# EAGLE design base_pcb_328_v3 (EAGLE 7.2.0)

## Sheet 1 of 3
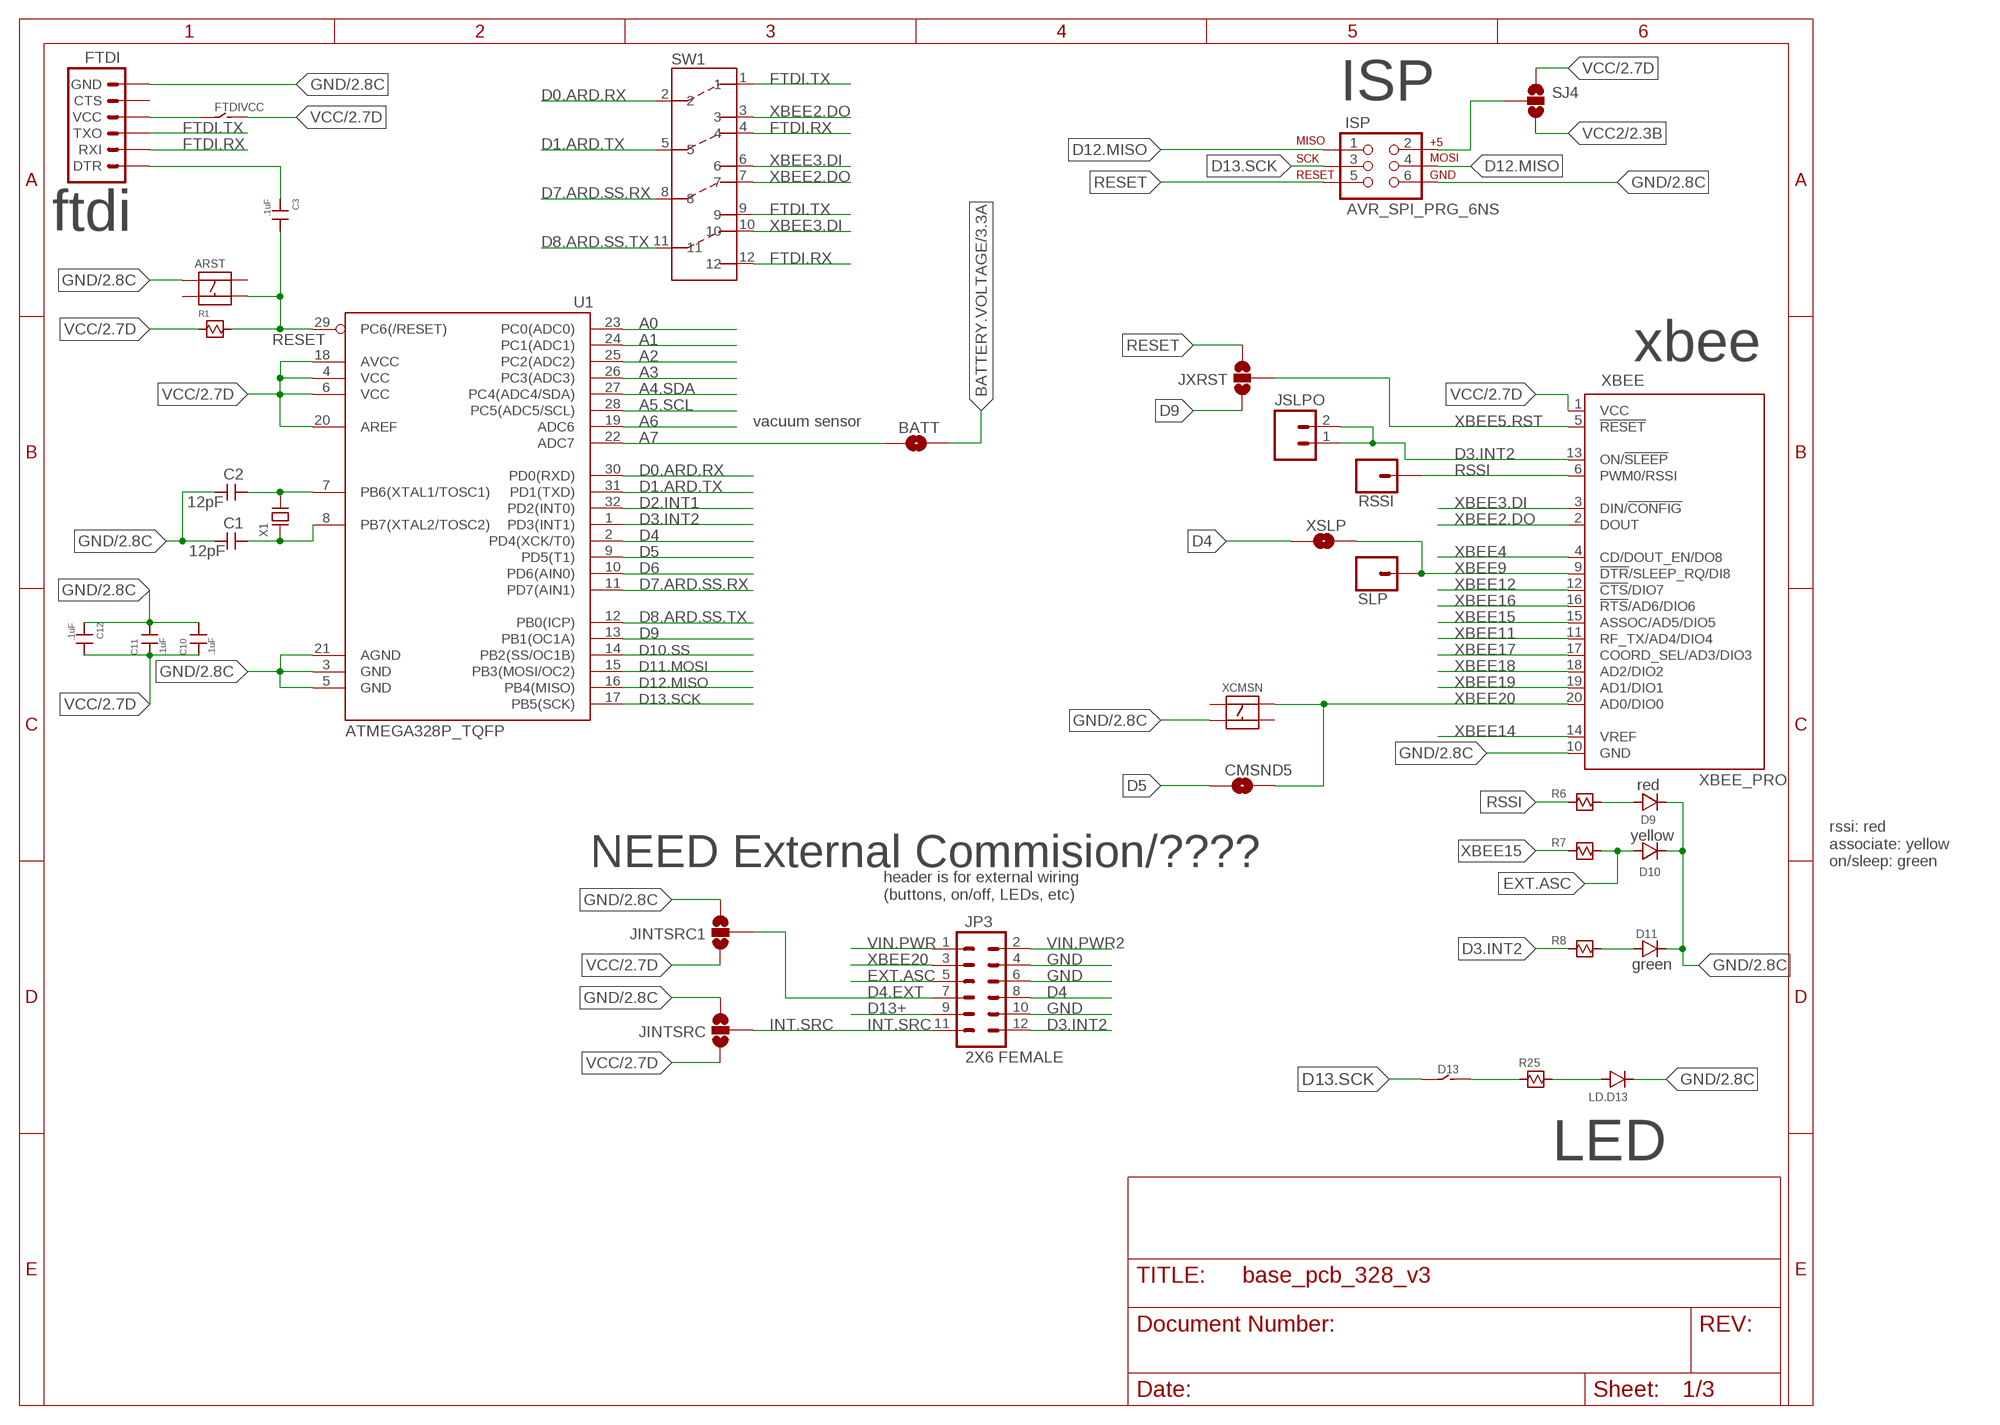
[diagram p0: schematic, sheet 1]

### Parts
ARST  C&K_PUSHBUTTON_SMALL_MOM_SPST_SMD  [C&K_PUSHBUTTON_MOM_SMALL_SPST_SMD]
BATT  JUMPER-PAD-2-NOYES_SILK  [PAD-JUMPER-2-NO_YES_SILK]
C1  12pF  0603_CAPACITOR  [0603_CAPACITOR]
C2  12pF  0603_CAPACITOR  [0603_CAPACITOR]
C3  .1uF  0603_CAPACITOR  [0603_CAPACITOR]
C10  .1uF  0402_CAPACITOR  [0402_CAPACITOR]
C11  .1uF  0402_CAPACITOR  [0402_CAPACITOR]
C12  .1uF  0402_CAPACITOR  [0402_CAPACITOR]
CMSND5  JUMPER-PAD-2-NOYES_SILK  [PAD-JUMPER-2-NO_YES_SILK]
D9  0603_LED  [0603_LED]
D10  0603_LED  [0603_LED]
D11  0603_LED  [0603_LED]
D13  JUMPER_2WAY_.1"_TH  [JUMPER_2WAY_.1"_TH]
FTDI  ARDUINO_SERIAL_PROGRAMPTH  [1X06]
FTDIVCC  JUMPER_2WAY_.1"_TH  [JUMPER_2WAY_.1"_TH]
ISP  AVR_SPI_PRG_6NS  [2X3-NS]
JINTSRC  JUMPER-PAD-3-NOYES_SILK  [PAD-JUMPER-3-NO_YES_SILK]
JINTSRC1  JUMPER-PAD-3-NOYES_SILK  [PAD-JUMPER-3-NO_YES_SILK]
JP3  2X6 FEMALE  M06X2PTH_FEMALE  [2X6]
JSLPO  M02PTH  [1X02]
JXRST  JUMPER-PAD-3-NOYES_SILK  [PAD-JUMPER-3-NO_YES_SILK]
LD.D13  0603_LED  [0603_LED]
R1  0603_RESISTOR  [0603_RESISTOR]
R6  0603_RESISTOR  [0603_RESISTOR]
R7  0603_RESISTOR  [0603_RESISTOR]
R8  0603_RESISTOR  [0603_RESISTOR]
R25  0603_RESISTOR  [0603_RESISTOR]
RSSI  M01PTH  [1X01]
SJ4  JUMPER-PAD-3-NOYES_SILK  [PAD-JUMPER-3-NO_YES_SILK]
SLP  M01PTH  [1X01]
SW1  COPAL_4PDT_SLIDE_SWITCH_TH  [COPAL_4PDT_SLIDE_SWITCH]
U1  ATMEGA328P_TQFP  [TQFP32-08]
X1  ABRACON_ABM3-16.000MHZ-D2Y-T_OSCILLATOR  [ABRACON_ABM3-16.000MHZ-D2Y-T_OSCILLATOR]
XBEE  XBEE_PRO  [XBEE_PRO]
XCMSN  C&K_PUSHBUTTON_SMALL_MOM_SPST_SMD  [C&K_PUSHBUTTON_MOM_SMALL_SPST_SMD]
XSLP  JUMPER-PAD-2-NOYES_SILK  [PAD-JUMPER-2-NO_YES_SILK]

### Nets
A0: U1.23(PC0(ADC0)) ; also sheet 2
A1: U1.24(PC1(ADC1)) ; also sheet 2
A2: U1.25(PC2(ADC2)) ; also sheet 2
A3: U1.26(PC3(ADC3)) ; also sheet 2
A4.SDA: U1.27(PC4(ADC4/SDA)) ; also sheet 2
A5.SCL: U1.28(PC5(ADC5/SCL)) ; also sheet 2
A6: U1.19(ADC6) ; also sheet 2
A7: BATT.1 U1.22(ADC7)
BATTERY.VOLTAGE: BATT.2 ; also sheet 3
D0.ARD.RX: SW1.2 U1.30(PD0(RXD))
D1.ARD.TX: SW1.5 U1.31(PD1(TXD))
D2.INT1: U1.32(PD2(INT0)) ; also sheet 2
D3.INT2: JP3.12 JSLPO.1 JSLPO.2 R8.1 U1.1(PD3(INT1)) XBEE.13(ON/!SLEEP) ; also sheet 2
D4: JP3.8 U1.2(PD4(XCK/T0)) XSLP.1 ; also sheet 2
D4.EXT: JINTSRC1.2 JP3.7
D5: CMSND5.1 U1.9(PD5(T1)) ; also sheet 2
D6: U1.10(PD6(AIN0)) ; also sheet 2
D7.ARD.SS.RX: SW1.8 U1.11(PD7(AIN1))
D8.ARD.SS.TX: SW1.11 U1.12(PB0(ICP))
D9: JXRST.1 U1.13(PB1(OC1A)) ; also sheet 2
D10.SS: U1.14(PB2(SS/OC1B)) ; also sheet 2
D11.MOSI: U1.15(PB3(MOSI/OC2)) ; also sheet 2
D12.MISO: ISP.1 ISP.4 U1.16(PB4(MISO)) ; also sheet 2
D13+: JP3.9
D13.SCK: D13.P$1 ISP.3 U1.17(PB5(SCK)) ; also sheet 2
EXT.ASC: D10.1 JP3.5 R7.2
FTDI.RX: FTDI.2(RXI)
FTDI.TX: FTDI.3(TXO)
GND: ARST.1 C1.2 C2.2 C10.2 C11.2 C12.1 D9.2 D10.2 D11.2 FTDI.6(GND) ISP.6 JINTSRC1.3 JINTSRC.3 JP3.4 JP3.6 JP3.10 LD.D13.2 U1.3(GND) U1.5(GND) U1.21(AGND) XBEE.10(GND) XCMSN.3 ; also sheet 2,3
INT.SRC: JINTSRC.2 JP3.11
N$1: C2.1 U1.7(PB6(XTAL1/TOSC1)) X1.P$2
N$2: C1.1 U1.8(PB7(XTAL2/TOSC2)) X1.P$1
N$3: C3.1 FTDI.1(DTR)
N$5: LD.D13.1 R25.2
N$6: D13.P$2 R25.1
N$11: ISP.2 SJ4.2
N$24: D9.1 R6.2
N$33: D11.1 R8.2
RESET: ARST.4 C3.2 ISP.5 JXRST.3 R1.2 U1.29(PC6(/RESET))
RSSI: R6.1 RSSI.1 XBEE.6(PWM0/RSSI) ; also sheet 2
VCC: C10.1 C11.1 C12.2 FTDI.4(VCC) FTDIVCC.P$1 FTDIVCC.P$2 JINTSRC1.1 JINTSRC.1 R1.1 SJ4.1 U1.4(VCC) U1.6(VCC) U1.18(AVCC) U1.20(AREF) XBEE.1(VCC) ; also sheet 2,3
VCC2: SJ4.3 ; also sheet 2,3
VIN.PWR: JP3.1 ; also sheet 2,3
VIN.PWR2: JP3.2 ; also sheet 3
XBEE2.DO: XBEE.2(DOUT) ; also sheet 2
XBEE3.DI: XBEE.3(DIN/!CONFIG) ; also sheet 2
XBEE4: XBEE.4(CD/DOUT_EN/DO8) ; also sheet 2
XBEE5.RST: JXRST.2 XBEE.5(!RESET) ; also sheet 2
XBEE9: SLP.1 XBEE.9(!DTR!/SLEEP_RQ/DI8) XSLP.2 ; also sheet 2
XBEE11: XBEE.11(RF_TX/AD4/DIO4) ; also sheet 2
XBEE12: XBEE.12(!CTS!/DIO7) ; also sheet 2
XBEE14: XBEE.14(VREF) ; also sheet 2
XBEE15: R7.1 XBEE.15(ASSOC/AD5/DIO5) ; also sheet 2
XBEE16: XBEE.16(!RTS!/AD6/DIO6) ; also sheet 2
XBEE17: XBEE.17(COORD_SEL/AD3/DIO3) ; also sheet 2
XBEE18: XBEE.18(AD2/DIO2) ; also sheet 2
XBEE19: XBEE.19(AD1/DIO1) ; also sheet 2
XBEE20: CMSND5.2 JP3.3 XBEE.20(AD0/DIO0) XCMSN.2 ; also sheet 2
Unconnected: ARST.2 ARST.3 FTDI.5(CTS) SW1.1 SW1.3 SW1.4 SW1.6 SW1.7 SW1.9 SW1.10 SW1.12 XCMSN.1 XCMSN.4

### Notes on the sheet
- ISP
- ftdi
- xbee
- vacuum sensor
- red
- yellow
- NEED External Commision/????
- rssi: red
  associate: yellow
  on/sleep: green
- header is for external wiring
  (buttons, on/off, LEDs, etc)
- green
- LED

## Sheet 2 of 3
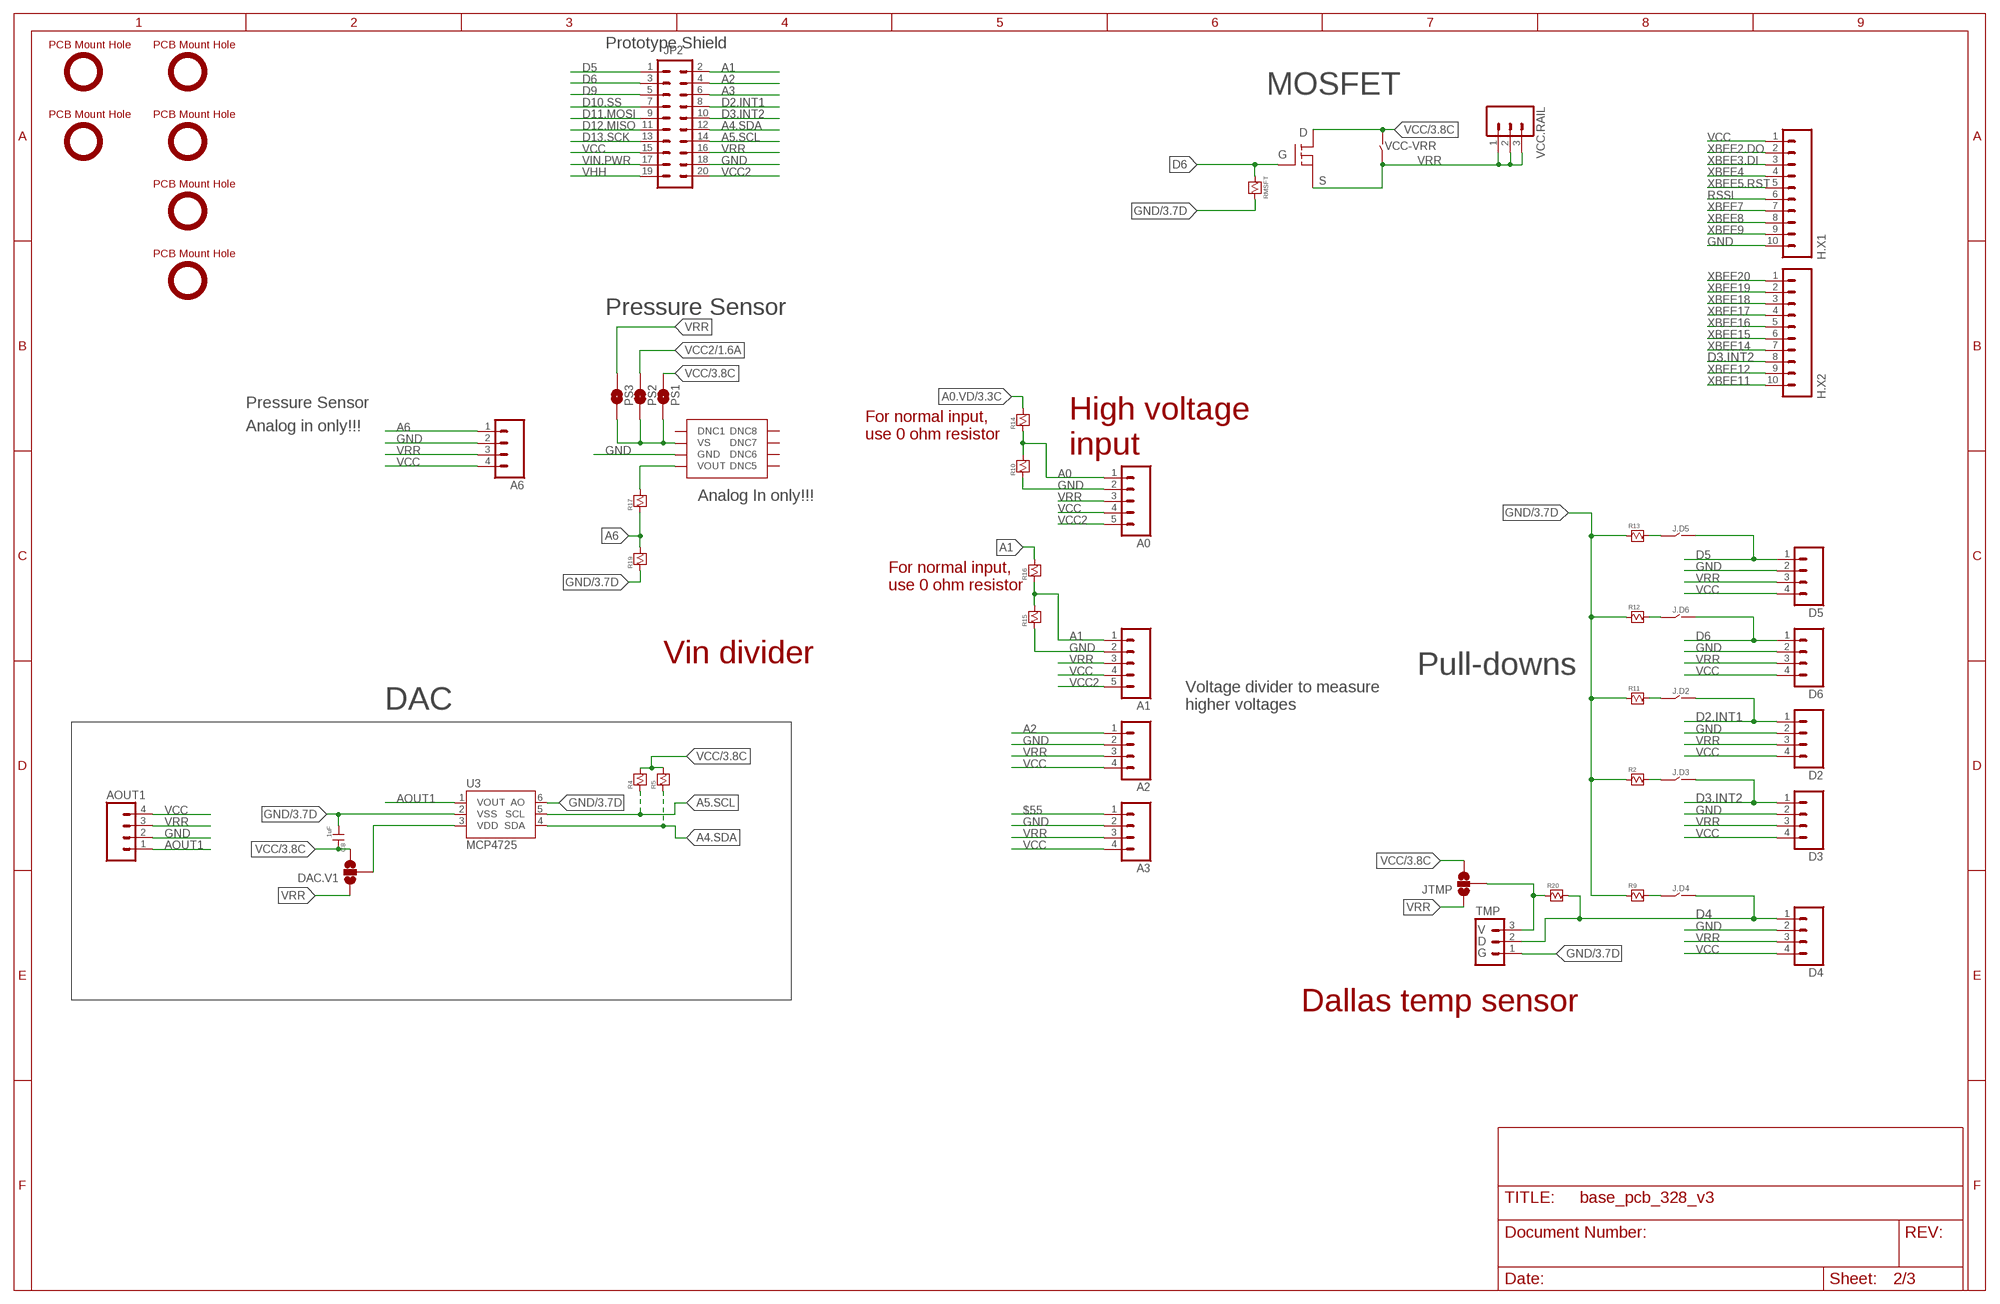
[diagram p1: schematic, sheet 2]

### Parts
A0  M05PTH  [1X05]
A1  M05PTH  [1X05]
A2  M04PTH  [1X04]
A3  M04PTH  [1X04]
A6  M04PTH  [1X04]
AOUT1  M04PTH  [1X04]
C8  .1uF  0603_CAPACITOR  [0603_CAPACITOR]
D2  M04PTH  [1X04]
D3  M04PTH  [1X04]
D4  M04PTH  [1X04]
D5  M04PTH  [1X04]
D6  M04PTH  [1X04]
DAC.V1  JUMPER-PAD-3-NOYES_SILK  [PAD-JUMPER-3-NO_YES_SILK]
H.X1  M10NO_SILK_PTH_FEMALE  [1X10_NO_SILK]
H.X2  M10NO_SILK_PTH_FEMALE  [1X10_NO_SILK]
J.D2  JUMPER_2WAY_.1"_TH  [JUMPER_2WAY_.1"_TH]
J.D3  JUMPER_2WAY_.1"_TH  [JUMPER_2WAY_.1"_TH]
J.D4  JUMPER_2WAY_.1"_TH  [JUMPER_2WAY_.1"_TH]
J.D5  JUMPER_2WAY_.1"_TH  [JUMPER_2WAY_.1"_TH]
J.D6  JUMPER_2WAY_.1"_TH  [JUMPER_2WAY_.1"_TH]
JP2  M10X2  [2X10]
JTMP  JUMPER-PAD-3-NOYES_SILK  [PAD-JUMPER-3-NO_YES_SILK]
PS1  JUMPER-PAD-2-NOYES_SILK  [PAD-JUMPER-2-NO_YES_SILK]
PS2  JUMPER-PAD-2-NOYES_SILK  [PAD-JUMPER-2-NO_YES_SILK]
PS3  JUMPER-PAD-2-NOYES_SILK  [PAD-JUMPER-2-NO_YES_SILK]
Q2  INFINEON_MOSFET_NCH  [INFINEON_MOSFET_NCH_SMD]
R2  0603_RESISTOR  [0603_RESISTOR]
R4  0603_RESISTOR  [0603_RESISTOR]
R5  0603_RESISTOR  [0603_RESISTOR]
R9  0603_RESISTOR  [0603_RESISTOR]
R10  0603_RESISTOR  [0603_RESISTOR]
R11  0603_RESISTOR  [0603_RESISTOR]
R12  0603_RESISTOR  [0603_RESISTOR]
R13  0603_RESISTOR  [0603_RESISTOR]
R14  0603_RESISTOR  [0603_RESISTOR]
R15  0603_RESISTOR  [0603_RESISTOR]
R16  0603_RESISTOR  [0603_RESISTOR]
R17  0603_RESISTOR  [0603_RESISTOR]
R19  0603_RESISTOR  [0603_RESISTOR]
R20  0603_RESISTOR  [0603_RESISTOR]
RMSFT  0603_RESISTOR  [0603_RESISTOR]
TMP  M03PTH  [1X03]
U3  MCP4725  MCP4725SOT-23  [SOT23-6]
U$2  PCB_HOLE  [PCB_HOLE]
U$4  PCB_HOLE  [PCB_HOLE]
U$5  PCB_HOLE  [PCB_HOLE]
U$6  PCB_HOLE  [PCB_HOLE]
U$9  MPXV6115VC6U  [MPXV6115VC6U]
U$13  PCB_HOLE  [PCB_HOLE]
U$14  PCB_HOLE  [PCB_HOLE]
VCC-VRR  JUMPER_2WAY_.1"_TH  [JUMPER_2WAY_.1"_TH]
VCC.RAIL  M03PTH  [1X03]

### Nets
$55: A3.1
A0: A0.1 R10.2 R14.1 ; also sheet 1
A0.VD: R14.2 ; also sheet 3
A1: A1.1 JP2.2 R15.2 R16.1 R16.2 ; also sheet 1
A2: A2.1 JP2.4 ; also sheet 1
A3: JP2.6 ; also sheet 1
A4.SDA: JP2.12 R5.1 U3.4(SDA) ; also sheet 1
A5.SCL: JP2.14 R4.1 U3.5(SCL) ; also sheet 1
A6: A6.1 R17.1 R19.2 ; also sheet 1
A6.IN: R17.2 U$9.4(VOUT)
AOUT1: AOUT1.1 U3.1(VOUT)
D2.INT1: D2.1 J.D2.P$2 JP2.8 ; also sheet 1
D3.INT2: D3.1 H.X2.8 J.D3.P$2 JP2.10 ; also sheet 1
D4: D4.1 J.D4.P$2 R20.2 TMP.2 ; also sheet 1
D5: D5.1 J.D5.P$2 ; also sheet 1
D6: D6.1 J.D6.P$2 JP2.3 Q2.G RMSFT.1 ; also sheet 1
D9: JP2.5 ; also sheet 1
D10.SS: JP2.7 ; also sheet 1
D11.MOSI: JP2.9 ; also sheet 1
D12.MISO: JP2.11 ; also sheet 1
D13.SCK: JP2.13 ; also sheet 1
GND: A0.2 A1.2 A2.2 A3.2 A6.2 AOUT1.2 C8.1 D2.2 D3.2 D4.2 D5.2 D6.2 H.X1.10 JP2.18 R2.1 R9.1 R10.1 R11.1 R12.1 R13.1 R15.1 R19.1 RMSFT.2 TMP.1 U3.2(VSS) U3.6(AO) U$9.3(GND) ; also sheet 1,3
N$13: PS1.1 PS2.1 PS3.1 U$9.2(VS)
N$20: J.D3.P$1 R2.2
N$21: J.D6.P$1 R12.2
N$22: J.D5.P$1 R13.2
N$25: J.D2.P$1 R11.2
N$34: J.D4.P$1 R9.2
N$35: JTMP.2 R20.1 TMP.3
RSSI: H.X1.6 ; also sheet 1
VCC: A0.4 A1.4 A2.4 A3.4 A6.4 AOUT1.4 C8.2 D2.4 D3.4 D4.4 D5.4 D6.4 DAC.V1.2 DAC.V1.3 H.X1.1 JP2.15 JTMP.3 PS1.2 Q2.D R4.2 R5.2 U3.3(VDD) VCC-VRR.P$2 ; also sheet 1,3
VCC2: A0.5 A1.5 PS2.2 ; also sheet 1,3
VIN.PWR: JP2.17 ; also sheet 1,3
VRR: A0.3 A1.3 A2.3 A3.3 A6.3 AOUT1.3 D2.3 D3.3 D4.3 D5.3 D6.3 DAC.V1.1 JP2.16 JTMP.1 PS3.2 Q2.S VCC-VRR.P$1 VCC.RAIL.1 VCC.RAIL.2 VCC.RAIL.3
XBEE2.DO: H.X1.2 ; also sheet 1
XBEE3.DI: H.X1.3 ; also sheet 1
XBEE4: H.X1.4 ; also sheet 1
XBEE5.RST: H.X1.5 ; also sheet 1
XBEE7: H.X1.7
XBEE8: H.X1.8
XBEE9: H.X1.9 ; also sheet 1
XBEE11: H.X2.10 ; also sheet 1
XBEE12: H.X2.9 ; also sheet 1
XBEE14: H.X2.7 ; also sheet 1
XBEE15: H.X2.6 ; also sheet 1
XBEE16: H.X2.5 ; also sheet 1
XBEE17: H.X2.4 ; also sheet 1
XBEE18: H.X2.3 ; also sheet 1
XBEE19: H.X2.2 ; also sheet 1
XBEE20: H.X2.1 ; also sheet 1
Unconnected: JP2.1 JP2.19 JP2.20 U$9.1(DNC1) U$9.5(DNC5) U$9.6(DNC6) U$9.7(DNC7) U$9.8(DNC8)

### Notes on the sheet
- Prototype Shield
- MOSFET
- Pressure Sensor
- Pressure Sensor
- Analog in only!!!
- For normal input, 
  use 0 ohm resistor
- High voltage 
  input
- Analog In only!!!
- For normal input, 
  use 0 ohm resistor
- Vin divider
- Pull-downs
- DAC
- Voltage divider to measure 
  higher voltages
- V
- D
- G
- Dallas temp sensor

## Sheet 3 of 3
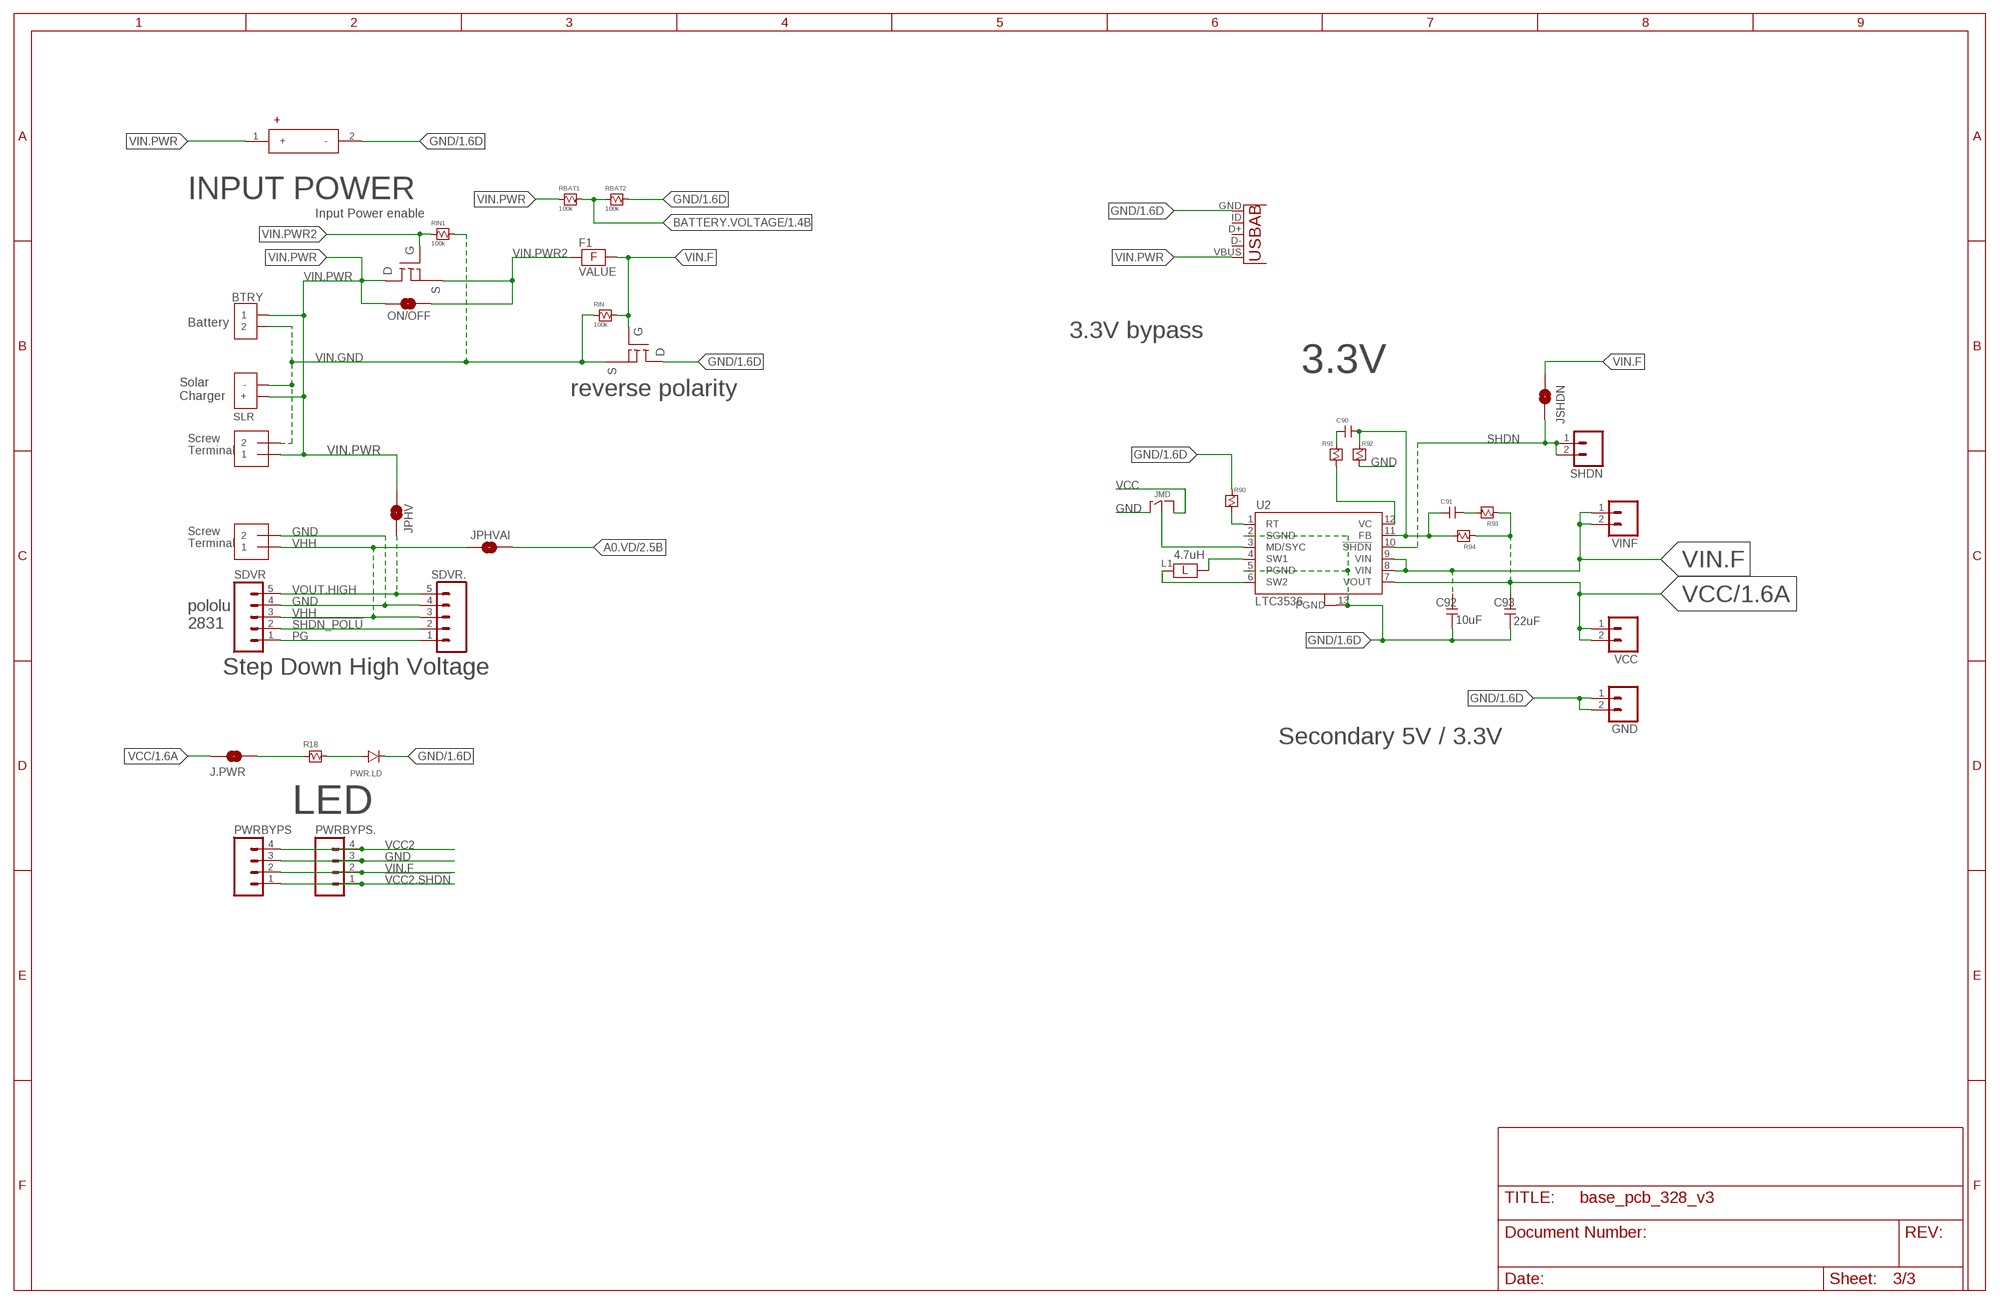
[diagram p2: schematic, sheet 3]

### Parts
BATTERY  BATTERY_HOLDER_18650  [BATTERY_HOLDER_18650]
BTRY  MOLEX_2PIN_LOCKING_TH  [MOLEX_2PIN_LOCKING_TH]
C90  0603_CAPACITOR  [0603_CAPACITOR]
C91  0603_CAPACITOR  [0603_CAPACITOR]
C92  10uF  0805_CAPACITOR  [0805_CAPACITOR]
C93  22uF  0805_CAPACITOR  [0805_CAPACITOR]
F1  PTC_FUSE_PTC_1206  [BEL_FUSE_PTC_FUSE_1206]
GND  M02PTH  [1X02]
INHPWR  1X2-3.5MM  [1X2-3.5MM]
INPWR  1X2-3.5MM  [1X2-3.5MM]
J.PWR  JUMPER-PAD-2-NOYES_SILK  [PAD-JUMPER-2-NO_YES_SILK]
JMD  JUMPER_3WAY_.1"_TH  [JUMPER_3WAY_.1"_TH]
JPHV  JUMPER-PAD-2-NOYES_SILK  [PAD-JUMPER-2-NO_YES_SILK]
JPHVAI  JUMPER-PAD-2-NOYES_SILK  [PAD-JUMPER-2-NO_YES_SILK]
JSHDN  JUMPER-PAD-2-NOYES_SILK  [PAD-JUMPER-2-NO_YES_SILK]
L1  4.7uH  BOURNS_INDUCTOR_SMD  [BOURNS_INDUCTOR_SMD]
ON/OFF  JUMPER-PAD-2-NOYES_SILK  [PAD-JUMPER-2-NO_YES_SILK]
PWR.LD  0603_LED  [0603_LED]
PWRBYPS  M04PTH  [1X04]
PWRBYPS.  M04PTH  [1X04]
Q1  INFINEON_MOSFET_NCH  [INFINEON_MOSFET_NCH_SMD]
Q3  INFINEON_MOSFET_NCH  [INFINEON_MOSFET_NCH_SMD]
R18  0603_RESISTOR  [0603_RESISTOR]
R90  0603_RESISTOR  [0603_RESISTOR]
R91  0603_RESISTOR  [0603_RESISTOR]
R92  0603_RESISTOR  [0603_RESISTOR]
R93  0603_RESISTOR  [0603_RESISTOR]
R94  0603_RESISTOR  [0603_RESISTOR]
RBAT1  100k  0603_RESISTOR  [0603_RESISTOR]
RBAT2  100k  0603_RESISTOR  [0603_RESISTOR]
RIN  100k  0603_RESISTOR  [0603_RESISTOR]
RIN1  100k  0603_RESISTOR  [0603_RESISTOR]
SDVR  M05PTH  [1X05]
SDVR.  M05PTH  [1X05]
SHDN  M02PTH  [1X02]
SLR  HEATH_SOLAR_CHARGER  [HEATH_SOLAR_CHARGER]
U2  LTC3536_ADJ_12PIN  [LTC3536_ADJ_12PIN]
U4  USB-AB  [USB-AB-MICRO-SMD]
VCC  M02PTH  [1X02]
VINF  M02PTH  [1X02]

### Nets
!SHDN_POLU: SDVR.2 SDVR..2
!VCC2.SHDN: PWRBYPS.1 PWRBYPS..1
A0.VD: JPHVAI.1 ; also sheet 2
BATTERY.VOLTAGE: RBAT1.2 RBAT2.1 ; also sheet 1
GND: BATTERY.2(-) C92.1 C93.1 GND.1 GND.2 INHPWR.2 JMD.P$3 PWR.LD.2 PWRBYPS.3 PWRBYPS..3 Q1.D R90.2 R92.1 RBAT2.2 SDVR.4 SDVR..4 U2.2(SGND) U2.5(PGND) U2.13(PGND) U4.GND ; also sheet 1,2
N$12: L1.P$2 U2.4(SW1)
N$15: J.PWR.1 R18.1
N$16: PWR.LD.1 R18.2
N$23: L1.P$1 U2.6(SW2)
N$26: R90.1 U2.1(RT)
N$27: C90.2 C91.1 R92.2 R94.2 U2.11(FB)
N$28: C90.1 R91.2
N$29: R91.1 U2.12(VC)
N$30: C91.2 R93.2
N$31: JMD.P$2 U2.3(MD/SYC)
PG: SDVR.1 SDVR..1
SHDN: JSHDN.2 SHDN.1 SHDN.2 U2.10(!SHDN)
VCC: C93.2 J.PWR.2 JMD.P$1 R93.1 R94.1 U2.7(VOUT) VCC.1 VCC.2 ; also sheet 1,2
VCC2: PWRBYPS.4 PWRBYPS..4 ; also sheet 1,2
VHH: INHPWR.1 JPHVAI.2 SDVR.3 SDVR..3 ; also sheet 2
VIN.F: C92.2 F1.P$2 JSHDN.1 PWRBYPS.2 PWRBYPS..2 Q1.G RIN.2 U2.8(VIN) U2.9(VIN) VINF.1 VINF.2
VIN.GND: BTRY.2 INPWR.2 Q1.S RIN1.2 RIN.1 SLR.-
VIN.PWR: BATTERY.1(+) BTRY.1 INPWR.1 JPHV.2 ON/OFF.1 Q3.D RBAT1.1 SLR.+ U4.VBUS ; also sheet 1,2
VIN.PWR2: F1.P$1 ON/OFF.2 Q3.G Q3.S RIN1.1 ; also sheet 1
VOUT.HIGH: JPHV.1 SDVR.5 SDVR..5
Unconnected: U4.D+ U4.D- U4.ID(USBID)

### Notes on the sheet
- INPUT POWER
- Input Power enable
- Battery
- 3.3V bypass
- 3.3V
- reverse polarity
- Solar 
  Charger
- Screw
  Terminal
- Screw
  Terminal
- 4.7uH
- pololu
  2831
- Step Down High Voltage
- Secondary 5V / 3.3V
- LED

## Library data of the parts
A0 A1 SDVR SDVR. = SparkFun-Connectors:M05: Header 5 Standard 5-pin 0.1" header. Use with straight break away headers (SKU : PRT-00116), right angle break away headers (PRT-00553), swiss pins (PRT-00743), machine pins (PRT-00117), and female headers (PRT-00115). Molex polarized connector foot print use with SKU : PRT-08230 with associated crimp pins and housings.
A2 A3 A6 AOUT1 D2-D6 PWRBYPS PWRBYPS. = SparkFun-Connectors:M04: Header 4 Standard 4-pin 0.1" header. Use with straight break away headers (SKU : PRT-00116), right angle break away headers (PRT-00553), swiss pins (PRT-00743), machine pins (PRT-00117), and female headers (PRT-00115). Molex polarized connector foot print use with SKU : PRT-08231 with associated crimp pins and housings. 1MM SMD Version SKU: PRT-10208
ARST XCMSN = Heath_control:C&K_PUSHBUTTON_SMALL_MOM_SPST_SMD: C&K: KMR742NG LFS Digikey: CKN10689CT-ND Description: SWITCH TACTILE SPST-NO 50MA 32V
BATT CMSND5 J.PWR JPHV JPHVAI JSHDN ON/OFF PS1-PS3 XSLP = SparkFun-Passives:JUMPER-PAD-2-NO
BATTERY = Heath_hardware:BATTERY_HOLDER_18650: Digikey: 36-1042-ND Keystone: 1042 Description: HOLDER BATTERY 1CELL 18650 SMD
BTRY = Heath_connectors:MOLEX_2PIN_LOCKING_TH: 2pin locking through hole
C1-C3 C8 C90 C91 = Heath_components:0603_CAPACITOR
C10-C12 = Heath_components:0402_CAPACITOR
C92 C93 = Heath_components:0805_CAPACITOR: 0805 samsung capacitor
D9-D11 LD.D13 PWR.LD = Heath_components:0603_LED
D13 FTDIVCC J.D2-J.D6 VCC-VRR = Heath_passives:JUMPER_2WAY_.1"_TH
DAC.V1 JINTSRC JINTSRC1 JTMP JXRST SJ4 = SparkFun-Passives:JUMPER-PAD-3-NO
F1 = Heath_circuit_protection:PTC_FUSE_PTC_1206: PTC resettable fuse, Bel Fuse, 1206 footprint
FTDI = SparkFun-Connectors:ARDUINO_SERIAL_PROGRAM: FTDI connector footprints
GND JSLPO SHDN VCC VINF = SparkFun-Connectors:M02: Standard 2-pin 0.1" header. Use with - straight break away headers ( PRT-00116) - right angle break away headers (PRT-00553) - swiss pins (PRT-00743) - machine pins (PRT-00117) - female headers (PRT-00115) Molex polarized connector foot print use with: PRT-08233 with associated crimp pins and housings. 2.54_SCREWTERM for use with PRT-10571. 3.5mm Screw Terminal footprints for PRT-08084 5mm Screw Terminal footprints for use with PRT-08432
H.X1 H.X2 = SparkFun-Connectors:M10: Header 10 Standard 10-pin 0.1" header. Use with straight break away headers (SKU : PRT-00116), right angle break away headers (PRT-00553), swiss pins (PRT-00743), machine pins (PRT-00117), and female headers (PRT-00115).; PROD_ID: CONN-11563
INHPWR INPWR = adafruit:1X2: 3.5mm Terminal block http://www.ladyada.net/library/pcb/eaglelibrary.html
ISP = SparkFun-Connectors:AVR_SPI_PRG_6: AVR ISP 6 Pin This is the reduced ISP connector for AVR programming. Common on Arduino. This footprint will take up less PCB space and can be used with a 10-pin to 6-pin adapter such as SKU: BOB-08508 **Special note about "TEST_POINT" package. The stop mask is on the top side, so if you want your programming test points to be on the bottom of your board, make sure to place this package on the bottom side of the board. This also ensure that the orientation to program from the bottom side will be correct.
JMD = Heath_passives:JUMPER_3WAY_.1"_TH
JP2 = SparkFun-Connectors:M10X2: This was SPECIALLY designed to be used with our Graphic LCD Backpack. Be sure you want to use this! It is not only staggered on each line of header holes, but IT IS ALSO offset of the center point of the top and bottom lines by 5 mil. This causes the headers to lock into place on the "standard" footprint on the LCD screen. The extra squares on the tdocu layer are there simply to reference other pins (if you were to actually populate a longer header than ten long - this is what we do with the backpacks).
JP3 = SparkFun-Connectors:M06X2; PROD_ID: CONN-12423
L1 = Heath_components:BOURNS_INDUCTOR_SMD: bourns inductor, 2.2uH - 10uH +, smd
Q1-Q3 = Heath_components:INFINEON_MOSFET_NCH: Infineon:IRLML6344TRPBF Digikey: IRLML6344TRPBFCT-ND Description: MOSFET N-CH 30V 5A SOT23
R1 R2 R4-R20 R25 R90-R94 RBAT1 RBAT2 RIN RIN1 RMSFT = Heath_components:0603_RESISTOR: 0603 footprint
RSSI SLP = SparkFun-Connectors:M01: Header 1 Standard 1-pin 0.1" header. Use with straight break away headers (SKU : PRT-00116), right angle break away headers (PRT-00553), swiss pins (PRT-00743), machine pins (PRT-00117), and female headers (PRT-00115).
SLR = Heath_boards:HEATH_SOLAR_CHARGER: CUSTOM SOLAR CHARGER V1
SW1 = Heath_control:COPAL_4PDT_SLIDE_SWITCH_TH: Copal:MFS401N-2-Z Digikey: 563-1568-ND Description: SWITCH SLIDE 4PDT 300MA 30V
TMP VCC.RAIL = SparkFun-Connectors:M03: Header 3 Standard 3-pin 0.1" header. Use with straight break away headers (SKU : PRT-00116), right angle break away headers (PRT-00553), swiss pins (PRT-00743), machine pins (PRT-00117), and female headers (PRT-00115). Molex polarized connector foot print use with SKU : PRT-08232 with associated crimp pins and housings.
U1 = SparkFun-DigitalIC:ATMEGA328P_TQFP; PROD_ID: IC-09069
U2 = Heath_power:LTC3536_ADJ_12PIN: LTC3536
U3 = SparkFun-AnalogIC:MCP4725: Microchip 12-bit I2C DAC, SOT23-6; PROD_ID: IC-08886
U4 = SparkFun-Connectors:USB-AB: This is a USB AB connector that is compatible with USB OTG. i.e. this connector can serve as a host or device
U$2 U$4-U$6 U$13 U$14 = Heath_hardware:PCB_HOLE
U$9 = Heath_sensors:MPXV6115VC6U: NXP: MPXV6115VC6U Digikey: MPXV6115VC6U-ND Description: SENSOR PRESSURE VACUUM -16.68PSI
X1 = GREENSEA_Signal_Quality:ABRACON_ABM3-16.000MHZ-D2Y-T_OSCILLATOR: Abracon: ABM3-16.000MHZ-D2Y-T Digikey: 535-10638-1-ND
XBEE = Heath_boards:XBEE_PRO: xbee pro

## Board
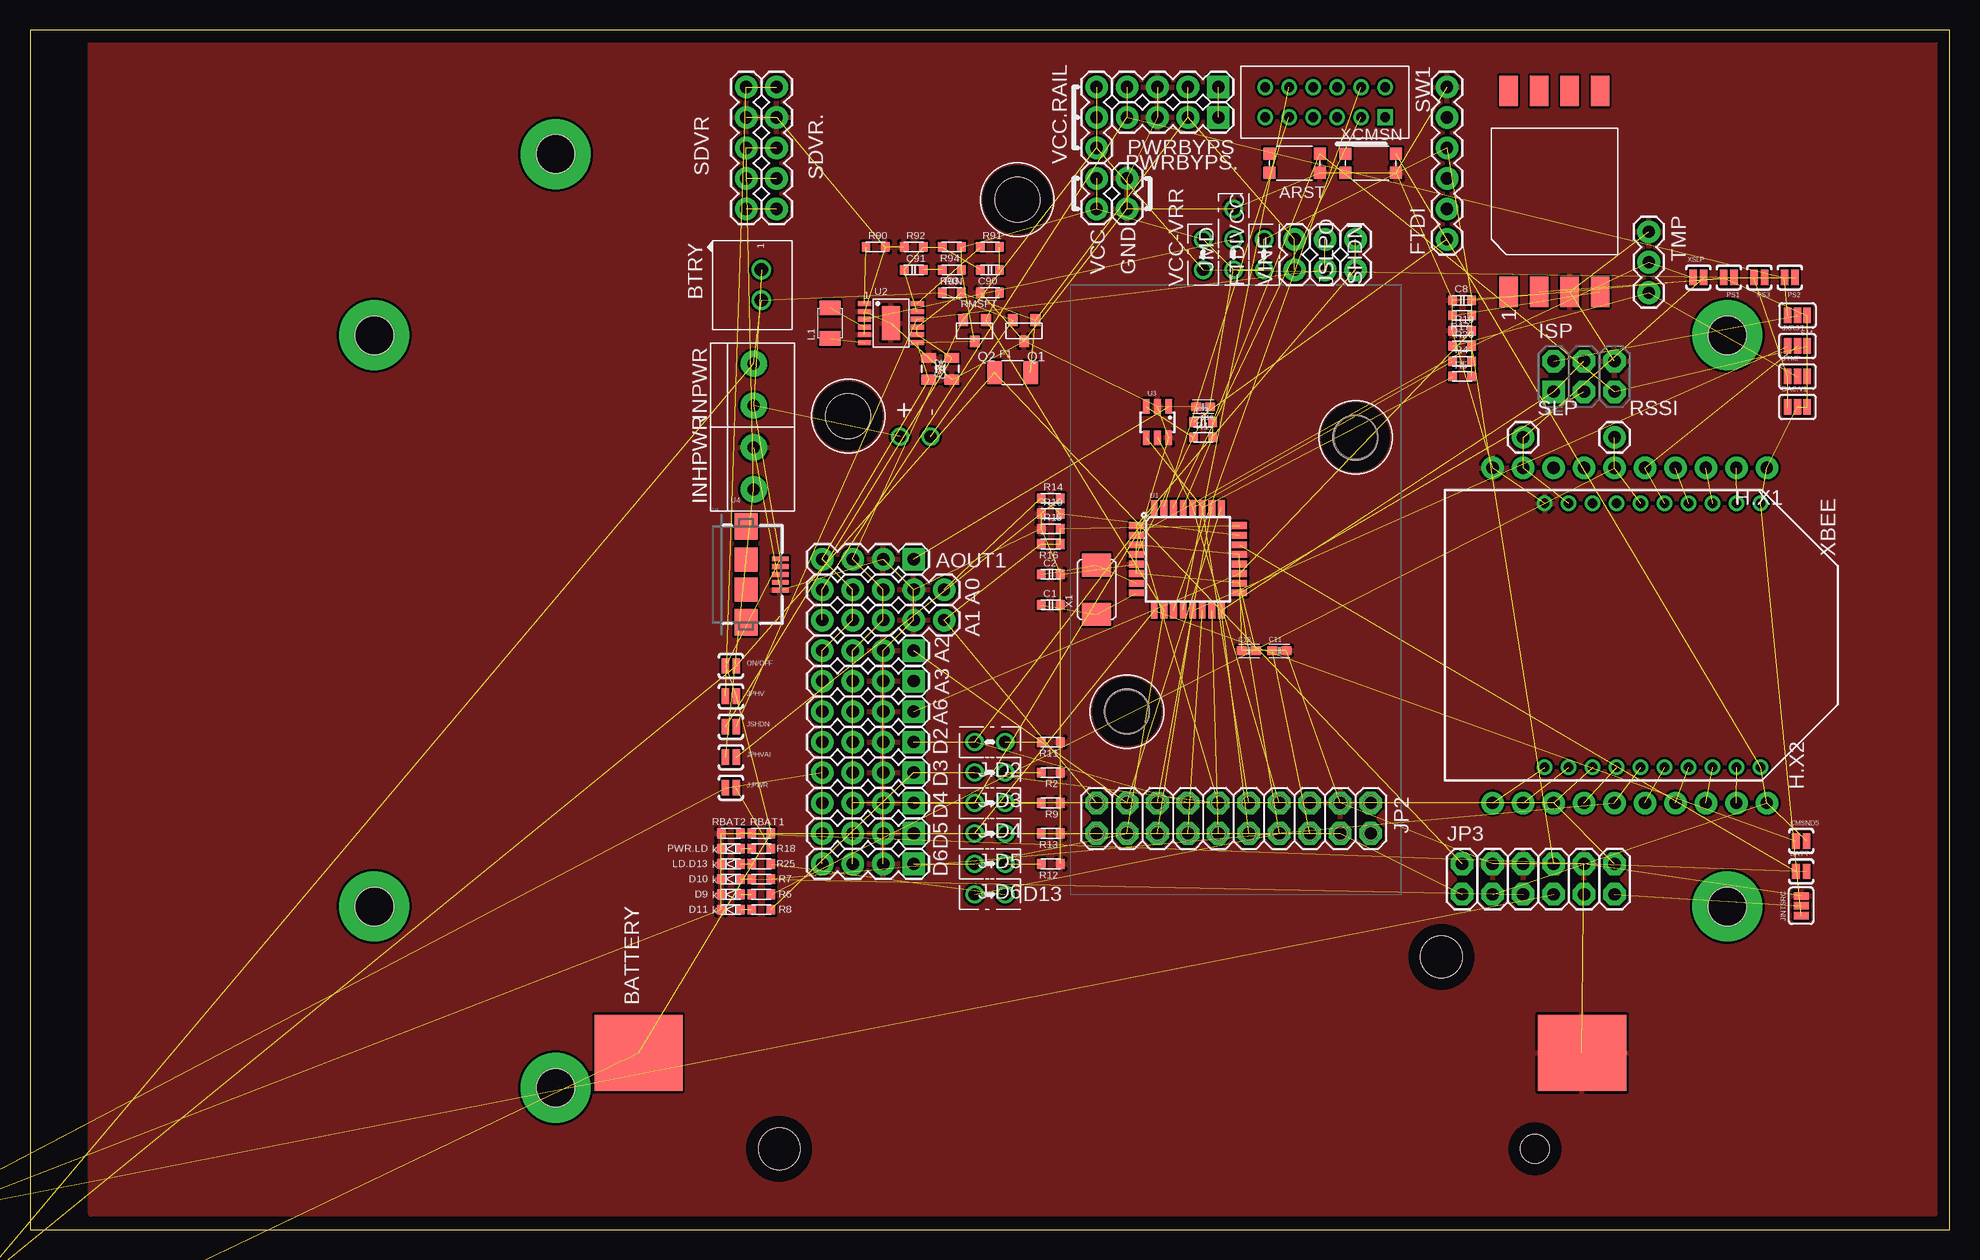
[diagram p3: board, top side]
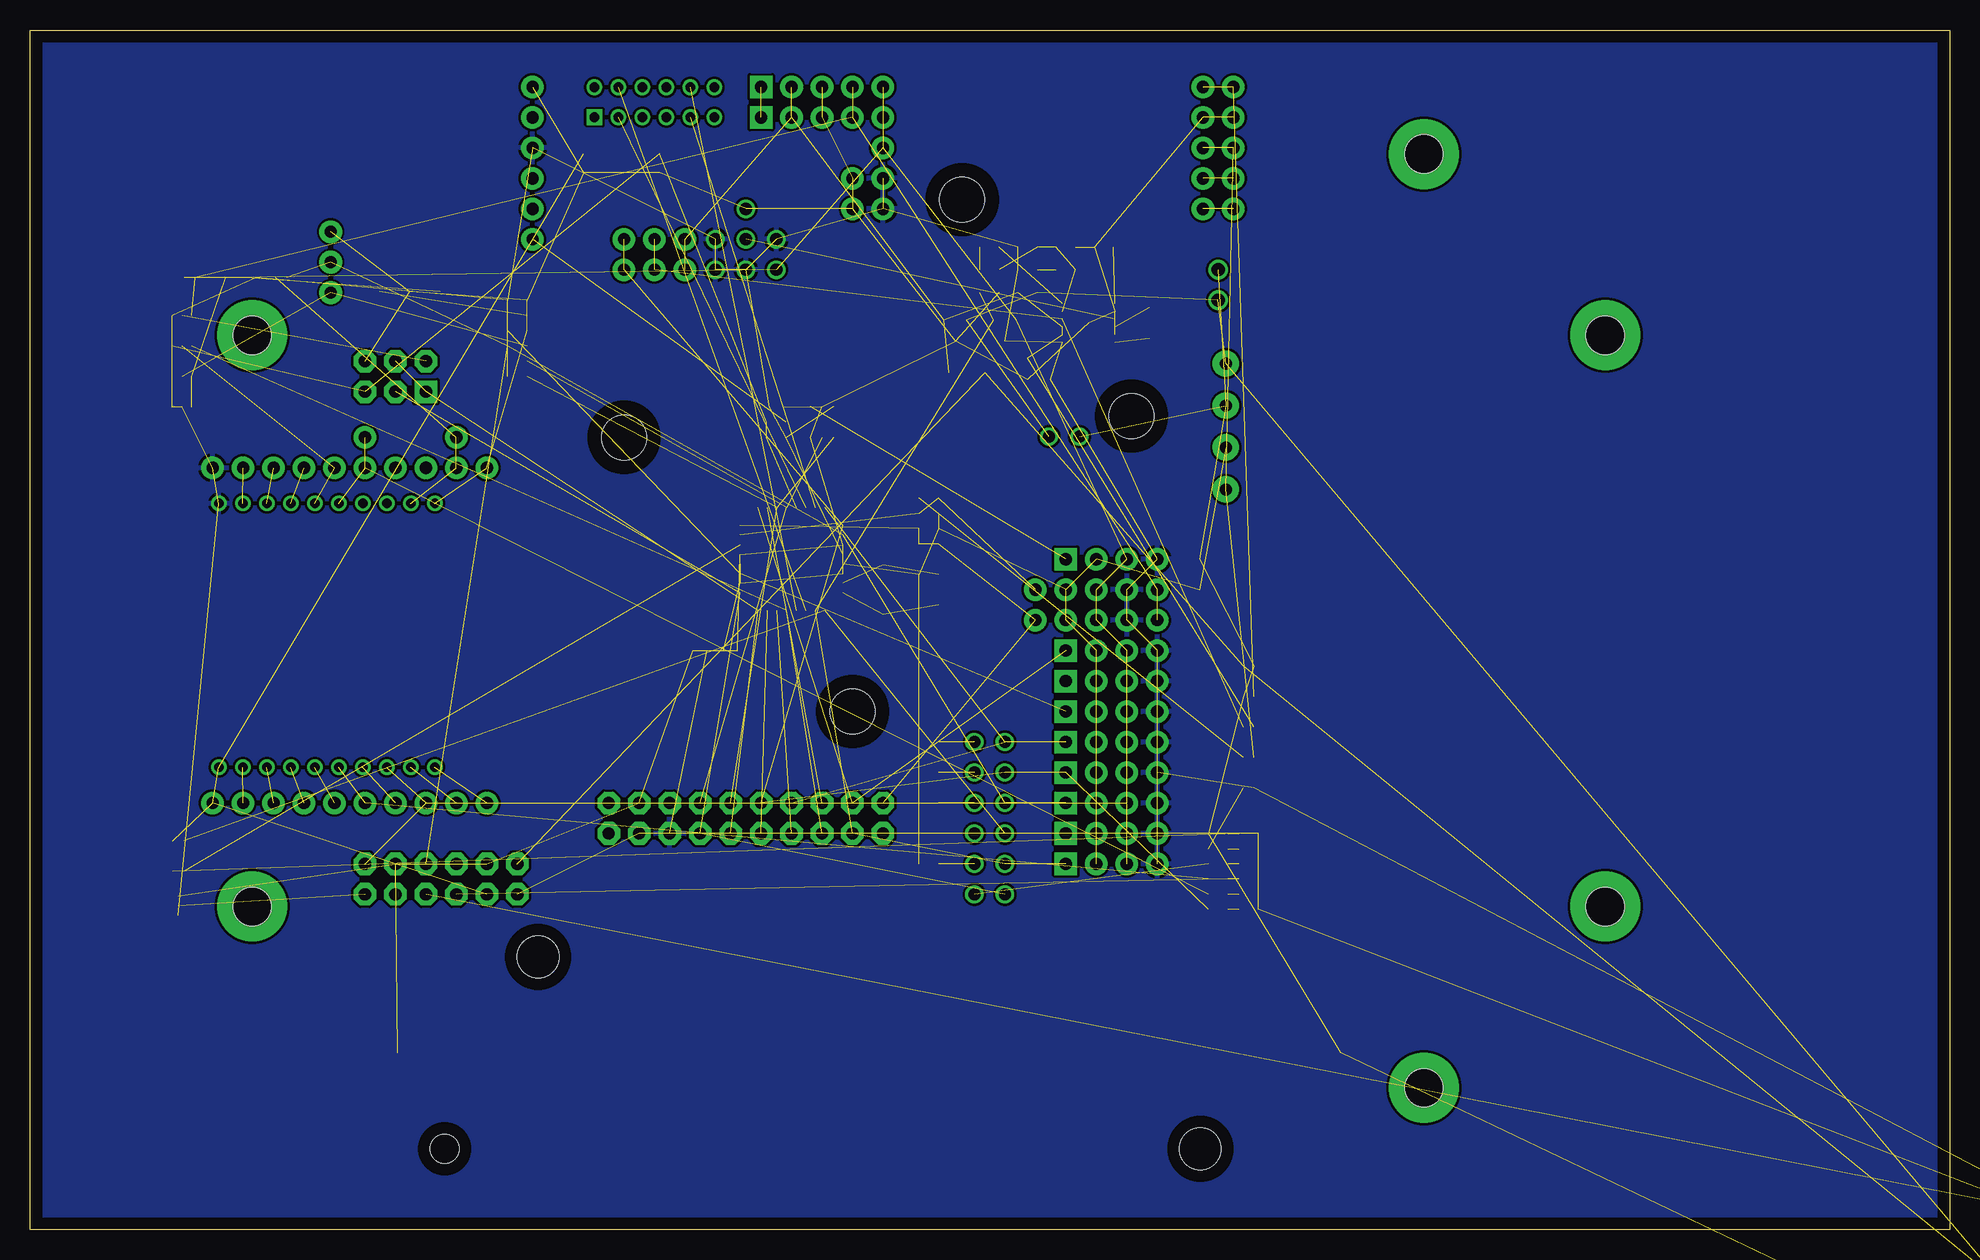
[diagram p4: board, bottom side, seen from below]

Size 160 x 100 mm. Coordinates in mm from the lower left corner, seen from the top.
Outline: 0,0 160,0 160,100 0,100 0,0
Copper layers (1*16): Top 0.035mm / dielectric 1.5mm / Bottom 0.035mm
Design rules "default": minimum track width 10mil, minimum drill 24mil, track to track 8mil, track to pad 8mil, pad to pad 8mil, via to via 8mil, smd to smd 8mil, copper to edge 40mil, drill to drill 8mil, minimum pad ring 10mil, minimum via ring 8mil, stop-mask expansion 4mil, vias tented up to drill 0mil, thermal gap 10mil

### Footprints (pad centres in the part's own frame; a part is rotated, then mirrored left to right if it is on the bottom)
1X05 = drill 1.016 pad 1.88: 1 0,0; 2 2.54,0; 3 5.08,0; 4 7.62,0; 5 10.16,0
1X04 = drill 1.016 pad 1.88 square: 1 0,0 | drill 1.016 pad 1.88: 2 2.54,0; 3 5.08,0; 4 7.62,0
C&K_PUSHBUTTON_MOM_SMALL_SPST_SMD = smd 1 x 1: 1 -2.1,0.8; 2 2.1,0.8; 3 2.1,-0.8; 4 -2.1,-0.8
PAD-JUMPER-2-NO_YES_SILK = smd 0.635 x 1.27: 1 -0.45,0; 2 0.45,0
BATTERY_HOLDER_18650 = smd 7.34 x 6.35: 1 -39.33,0; 2 39.33,0 | hole 3.45: -27.6,-8; 27.6,8 | hole 2.39: 35.39,-8
MOLEX_2PIN_LOCKING_TH = drill 1.1: 1 1.27,0; 2 -1.27,0
0603_CAPACITOR = smd 0.7 x 0.8: 1 -0.8,0; 2 0.8,0
0402_CAPACITOR = smd 0.813 x 0.711: 1 -0.58,0; 2 0.58,0
0805_CAPACITOR = smd 0.8 x 1.2: 1 -0.9,0; 2 0.9,0
0603_LED = smd 0.7 x 0.8: 1 -0.8,0; 2 0.8,0
JUMPER_2WAY_.1"_TH = drill 1.016: P$1 -1.27,0; P$2 1.27,0
PAD-JUMPER-3-NO_YES_SILK = smd 0.635 x 1.27: 1 -0.813,0; 2 0,0; 3 0.813,0
BEL_FUSE_PTC_FUSE_1206 = smd 1.2 x 1.9: P$1 -1.5,0; P$2 1.5,0
1X06 = drill 1.016 pad 1.88: 1 0,0; 2 2.54,0; 3 5.08,0; 4 7.62,0; 5 10.16,0; 6 12.7,0
1X02 = drill 1.016 pad 1.88: 1 0,0; 2 2.54,0
1X10_NO_SILK = drill 1.016 pad 1.88: 1 0,0; 2 2.54,0; 3 5.08,0; 4 7.62,0; 5 10.16,0; 6 12.7,0; 7 15.24,0; 8 17.78,0; 9 20.32,0; 10 22.86,0
1X2-3.5MM = drill 1 pad 2.184: 1 1.8,0; 2 -1.7,0
2X3-NS = drill 1.016 pad 1.88 square: 1 -2.54,-1.27 | drill 1.016 pad 1.88 octagon: 2 -2.54,1.27; 3 0,-1.27; 4 0,1.27; 5 2.54,-1.27; 6 2.54,1.27
JUMPER_3WAY_.1"_TH = drill 1.016: P$1 -2.54,0; P$2 0,0; P$3 2.54,0
2X10 = drill 1.016 pad 1.88 octagon: 1 -11.43,-1.27; 2 -11.43,1.27; 3 -8.89,-1.27; 4 -8.89,1.27; 5 -6.35,-1.27; 6 -6.35,1.27; 7 -3.81,-1.27; 8 -3.81,1.27; 9 -1.27,-1.27; 10 -1.27,1.27; 11 1.27,-1.27; 12 1.27,1.27; 13 3.81,-1.27; 14 3.81,1.27; 15 6.35,-1.27; 16 6.35,1.27; 17 8.89,-1.27; 18 8.89,1.27; 19 11.43,-1.27; 20 11.43,1.27
2X6 = drill 1.016 pad 1.88 octagon: 1 0,0; 2 0,2.54; 3 2.54,0; 4 2.54,2.54; 5 5.08,0; 6 5.08,2.54; 7 7.62,0; 8 7.62,2.54; 9 10.16,0; 10 10.16,2.54; 11 12.7,0; 12 12.7,2.54
BOURNS_INDUCTOR_SMD = smd 1.2 x 1.75: P$1 -1.275,0; P$2 1.275,0
INFINEON_MOSFET_NCH_SMD = smd 0.802 x 0.972: D 0,0.885; G -0.95,-0.885; S 0.95,-0.885
0603_RESISTOR = smd 0.7 x 0.8: 1 -0.8,0; 2 0.8,0
1X01 = drill 1.016 pad 1.88: 1 0,0
HEATH_SOLAR_CHARGER = drill 1.016: + 30.416,7.747; - 30.416,10.287
COPAL_4PDT_SLIDE_SWITCH = drill 0.8 square: 1 -5,1.25 | drill 0.8: 2 -3,1.25; 3 -1,1.25; 4 1,1.25; 5 3,1.25; 6 5,1.25; 7 -5,-1.25; 8 -3,-1.25; 9 -1,-1.25; 10 1,-1.25; 11 3,-1.25; 12 5,-1.25
1X03 = drill 1.016 pad 1.88: 1 0,0; 2 2.54,0; 3 5.08,0
TQFP32-08 = smd 1.27 x 0.559: 1 -4.293,2.8; 2 -4.293,2; 3 -4.293,1.2; 4 -4.293,0.4; 5 -4.293,-0.4; 6 -4.293,-1.2; 7 -4.293,-2; 8 -4.293,-2.8; 17 4.293,-2.8; 18 4.293,-2; 19 4.293,-1.2; 20 4.293,-0.4; 21 4.293,0.4; 22 4.293,1.2; 23 4.293,2; 24 4.293,2.8 | smd 0.559 x 1.27: 9 -2.8,-4.293; 10 -2,-4.293; 11 -1.2,-4.293; 12 -0.4,-4.293; 13 0.4,-4.293; 14 1.2,-4.293; 15 2,-4.293; 16 2.8,-4.293; 25 2.8,4.293; 26 2,4.293; 27 1.2,4.293; 28 0.4,4.293; 29 -0.4,4.293; 30 -1.2,4.293; 31 -2,4.293; 32 -2.8,4.293
LTC3536_ADJ_12PIN = smd 0.42 x 1.1: 1 -1.625,-2.2; 2 -0.975,-2.2; 3 -0.325,-2.2; 4 0.325,-2.2; 5 0.975,-2.2; 6 1.625,-2.2; 7 1.625,2.2; 8 0.975,2.2; 9 0.325,2.2; 10 -0.325,2.2; 11 -0.975,2.2; 12 -1.625,2.2 | smd 2.8 x 1.5: 13 0,0
SOT23-6 = smd 0.55 x 1.2: 1 0.95,1.3; 2 0,1.3; 3 -0.95,1.3; 4 -0.95,-1.3; 5 0,-1.3; 6 0.95,-1.3
USB-AB-MICRO-SMD = smd 1.4 x 0.4: D+ 2.85,0; D- 2.85,0.65; GND 2.85,-1.3; ID 2.85,-0.65; VBUS 2.85,1.3 | smd 1.9 x 2: P$6 0,1.25; P$7 0,-1.25 | smd 1.9 x 2.2: P$8 0,4; P$9 0,-4
PCB_HOLE = drill 3.175 pad 5.842: P$1 0,0 | hole 3.175: 0,0
PEM_2-56 = hole 3.734: 0,0
BASE328_SHIELD_1 = hole 3.734: 15.24,22.86; 38.1,3.81
MPXV6115VC6U = smd 2.54 x 1.524: 1 -8.382,3.81; 2 -8.382,1.27; 3 -8.382,-1.27; 4 -8.382,-3.81; 5 8.382,-3.81; 6 8.382,-1.27; 7 8.382,1.27; 8 8.382,3.81
ABRACON_ABM3-16.000MHZ-D2Y-T_OSCILLATOR = smd 1.9 x 2.4: P$1 -2.05,0; P$2 2.05,0
XBEE_PRO = drill 0.8 pad 1.27: 1 1.7,26.78; 2 1.7,24.78; 3 1.7,22.78; 4 1.7,20.78; 5 1.7,18.78; 6 1.7,16.78; 7 1.7,14.78; 8 1.7,12.78; 9 1.7,10.78; 10 1.7,8.78; 11 23.7,8.78; 12 23.7,10.78; 13 23.7,12.78; 14 23.7,14.78; 15 23.7,16.78; 16 23.7,18.78; 17 23.7,20.78; 18 23.7,22.78; 19 23.7,24.78; 20 23.7,26.78

### Placement (x,y rotation side)
A0  76.2,53.34 180 top
A1  76.2,50.8 180 top
A2  73.66,48.26 180 top
A3  73.66,45.72 180 top
A6  73.66,43.18 180 top
AOUT1  73.66,55.88 180 top
ARST  105.41,88.9 180 top
BATT  147.64,29.84 0 top
BATTERY  90.04,14.73 0 top
BTRY  60.96,78.74 90 top
C1  85.09,52.07 0 top
C2  85.09,54.61 0 top
C3  97.79,67.31 0 top
C8  119.38,77.47 0 top
C10  97.79,68.58 180 top
C11  104.14,48.26 0 top
C12  101.6,48.26 0 top
C90  80.01,80.01 180 top
C91  73.66,80.01 0 top
C92  76.83,71.75 90 top
C93  74.93,71.75 270 top
CMSND5  147.64,32.38 0 top
D2  73.66,40.64 180 top
D3  73.66,38.1 180 top
D4  73.66,35.56 180 top
D5  73.66,33.02 180 top
D6  73.66,30.48 180 top
D9  58.42,27.94 180 top
D10  58.42,29.21 180 top
D11  58.42,26.67 180 top
D13  80.01,27.94 0 top
DAC.V1  147.32,68.58 0 top
F1  81.92,71.44 0 top
FTDI  118.11,82.55 90 top
FTDIVCC  102.87,81.28 90 top
GND  91.44,85.09 90 top
H.X1  144.78,63.5 180 top
H.X2  144.78,35.56 180 top
INHPWR  60.33,63.5 270 top
INPWR  60.33,70.48 270 top
ISP  129.54,71.12 0 top
J.D2  80.01,40.64 180 top
J.D3  80.01,38.1 180 top
J.D4  80.01,35.56 180 top
J.D5  80.01,33.02 180 top
J.D6  80.01,30.48 180 top
J.PWR  58.42,36.83 180 top
JINTSRC  147.64,26.99 90 top
JINTSRC1  -8.89,1.27 0 top  (outside the outline)
JMD  100.33,82.55 90 top
JP2  100.33,34.29 0 top
JP3  119.38,27.94 0 top
JPHV  58.42,44.45 0 top
JPHVAI  58.42,39.37 180 top
JSHDN  58.42,41.91 0 top
JSLPO  110.49,80.01 90 top
JTMP  147.32,71.12 0 top
JXRST  147.32,73.66 0 top
L1  66.67,75.56 90 top
LD.D13  58.42,30.48 180 top
ON/OFF  58.42,46.99 0 top
PS1  141.6,79.38 180 top
PS2  146.69,79.38 180 top
PS3  144.15,79.38 180 top
PWR.LD  58.42,31.75 180 top
PWRBYPS  99.06,92.71 180 top
PWRBYPS.  99.06,95.25 180 top
Q1  82.87,74.93 180 top
Q2  78.74,74.93 180 top
Q3  -7.62,-13.97 0 top  (outside the outline)
R1  97.79,66.04 0 top
R2  85.09,38.1 180 top
R4  119.38,72.39 0 top
R5  119.38,71.12 0 top
R6  60.96,27.94 180 top
R7  60.96,29.21 180 top
R8  60.96,26.67 180 top
R9  85.09,35.56 180 top
R10  85.09,59.69 0 top
R11  85.09,40.64 180 top
R12  85.09,30.48 180 top
R13  85.09,33.02 180 top
R14  85.09,60.96 0 top
R15  85.09,58.42 0 top
R16  85.09,57.15 180 top
R17  119.38,76.2 180 top
R18  60.96,31.75 180 top
R19  119.38,74.93 0 top
R20  119.38,73.66 0 top
R25  60.96,30.48 180 top
R90  70.48,81.92 0 top
R91  80.01,81.92 0 top
R92  73.66,81.92 0 top
R93  76.83,80.01 180 top
R94  76.83,81.92 180 top
RBAT1  60.96,33.02 180 top
RBAT2  58.42,33.02 180 top
RIN  76.83,78.11 0 top
RIN1  -8.89,-8.89 0 top  (outside the outline)
RMSFT  80.01,78.11 180 top
RSSI  132.08,66.04 0 top
SDVR  59.69,85.09 90 top
SDVR.  62.23,85.09 90 top
SHDN  107.95,82.55 270 top
SJ4  147.32,76.2 180 top
SLP  124.46,66.04 0 top
SLR  64.77,96.52 270 top
SW1  107.95,93.98 180 top
TMP  134.94,83.19 270 top
U1  96.52,55.88 0 top
U2  71.75,75.56 270 top
U3  93.98,67.31 0 top
U4  59.69,54.61 0 top
U$1  [POLYCASE_PCB_FOOTPRINT_5.5X4.1]  85.09,50.8 0 top
U$2  43.81,11.81 0 top
U$3  [PEM_2-56]  82.3,85.85 0 top
U$4  28.7,26.92 0 top
U$5  28.7,74.55 0 top
U$6  43.81,89.66 0 top
U$8  [BASE328_SHIELD_1]  114.3,27.94 90 top
U$9  127.06,86.55 90 top
U$10  [PEM_2-56]  68.2,67.82 0 top
U$13  141.48,74.55 0 top
U$14  141.48,26.92 0 top
VCC  88.9,85.09 90 top
VCC-VRR  97.79,81.28 90 top
VCC.RAIL  88.9,90.17 90 top
VINF  105.41,80.01 90 top
X1  88.9,53.34 90 top
XBEE  117.47,62.23 270 top
XCMSN  111.76,88.9 0 top
XSLP  139.06,79.38 0 top

### Tracks (layer width: path | path; a pad name or v marks a point on that pad's centre or on a via)
!SHDN_POLU  (1 unrouted)
!VCC2.SHDN  (1 unrouted)
A0  (3 unrouted)
A0.VD  (1 unrouted)
A1  (5 unrouted)
A2  (2 unrouted)
A3  (1 unrouted)
A4.SDA  (3 unrouted)
A5.SCL  (3 unrouted)
A6  (3 unrouted)
A6.IN  (1 unrouted)
A7  (1 unrouted)
AOUT1  (1 unrouted)
BATTERY.VOLTAGE  (2 unrouted)
D0.ARD.RX  (1 unrouted)
D1.ARD.TX  (1 unrouted)
D2.INT1  (3 unrouted)
D3.INT2  (9 unrouted)
D4  (6 unrouted)
D4.EXT  (1 unrouted)
D5  (3 unrouted)
D6  (5 unrouted)
D7.ARD.SS.RX  (1 unrouted)
D8.ARD.SS.TX  (1 unrouted)
D9  (2 unrouted)
D10.SS  (1 unrouted)
D11.MOSI  (1 unrouted)
D12.MISO  (3 unrouted)
D13.SCK  (3 unrouted)
EXT.ASC  (2 unrouted)
GND  (68 unrouted)
  pour Top: 5.08,99.06 158.75,99.06 158.75,1.27 5.08,1.27
INT.SRC  (1 unrouted)
N$1  (2 unrouted)
N$2  (2 unrouted)
N$3  (1 unrouted)
N$5  (1 unrouted)
N$6  (1 unrouted)
N$11  (1 unrouted)
N$12  (1 unrouted)
N$13  (3 unrouted)
N$15  (1 unrouted)
N$16  (1 unrouted)
N$20  (1 unrouted)
N$21  (1 unrouted)
N$22  (1 unrouted)
N$23  (1 unrouted)
N$24  (1 unrouted)
N$25  (1 unrouted)
N$26  (1 unrouted)
N$27  (4 unrouted)
N$28  (1 unrouted)
N$29  (1 unrouted)
N$30  (1 unrouted)
N$31  (1 unrouted)
N$33  (1 unrouted)
N$34  (1 unrouted)
N$35  (2 unrouted)
PG  (1 unrouted)
RESET  (5 unrouted)
RSSI  (3 unrouted)
SHDN  (3 unrouted)
VCC  (45 unrouted)
  pour Bottom: -1.27,100.33 161.29,100.33 161.29,-1.27 -1.27,-1.27
VCC2  (5 unrouted)
VHH  (3 unrouted)
VIN.F  (10 unrouted)
VIN.GND  (5 unrouted)
VIN.PWR  (10 unrouted)
VIN.PWR2  (5 unrouted)
VOUT.HIGH  (2 unrouted)
VRR  (19 unrouted)
XBEE2.DO  (1 unrouted)
XBEE3.DI  (1 unrouted)
XBEE4  (1 unrouted)
XBEE5.RST  (2 unrouted)
XBEE9  (3 unrouted)
XBEE11  (1 unrouted)
XBEE12  (1 unrouted)
XBEE14  (1 unrouted)
XBEE15  (2 unrouted)
XBEE16  (1 unrouted)
XBEE17  (1 unrouted)
XBEE18  (1 unrouted)
XBEE19  (1 unrouted)
XBEE20  (4 unrouted)